# Altium schematic sheet 倒计时八路抢答器.SchDoc
size A4
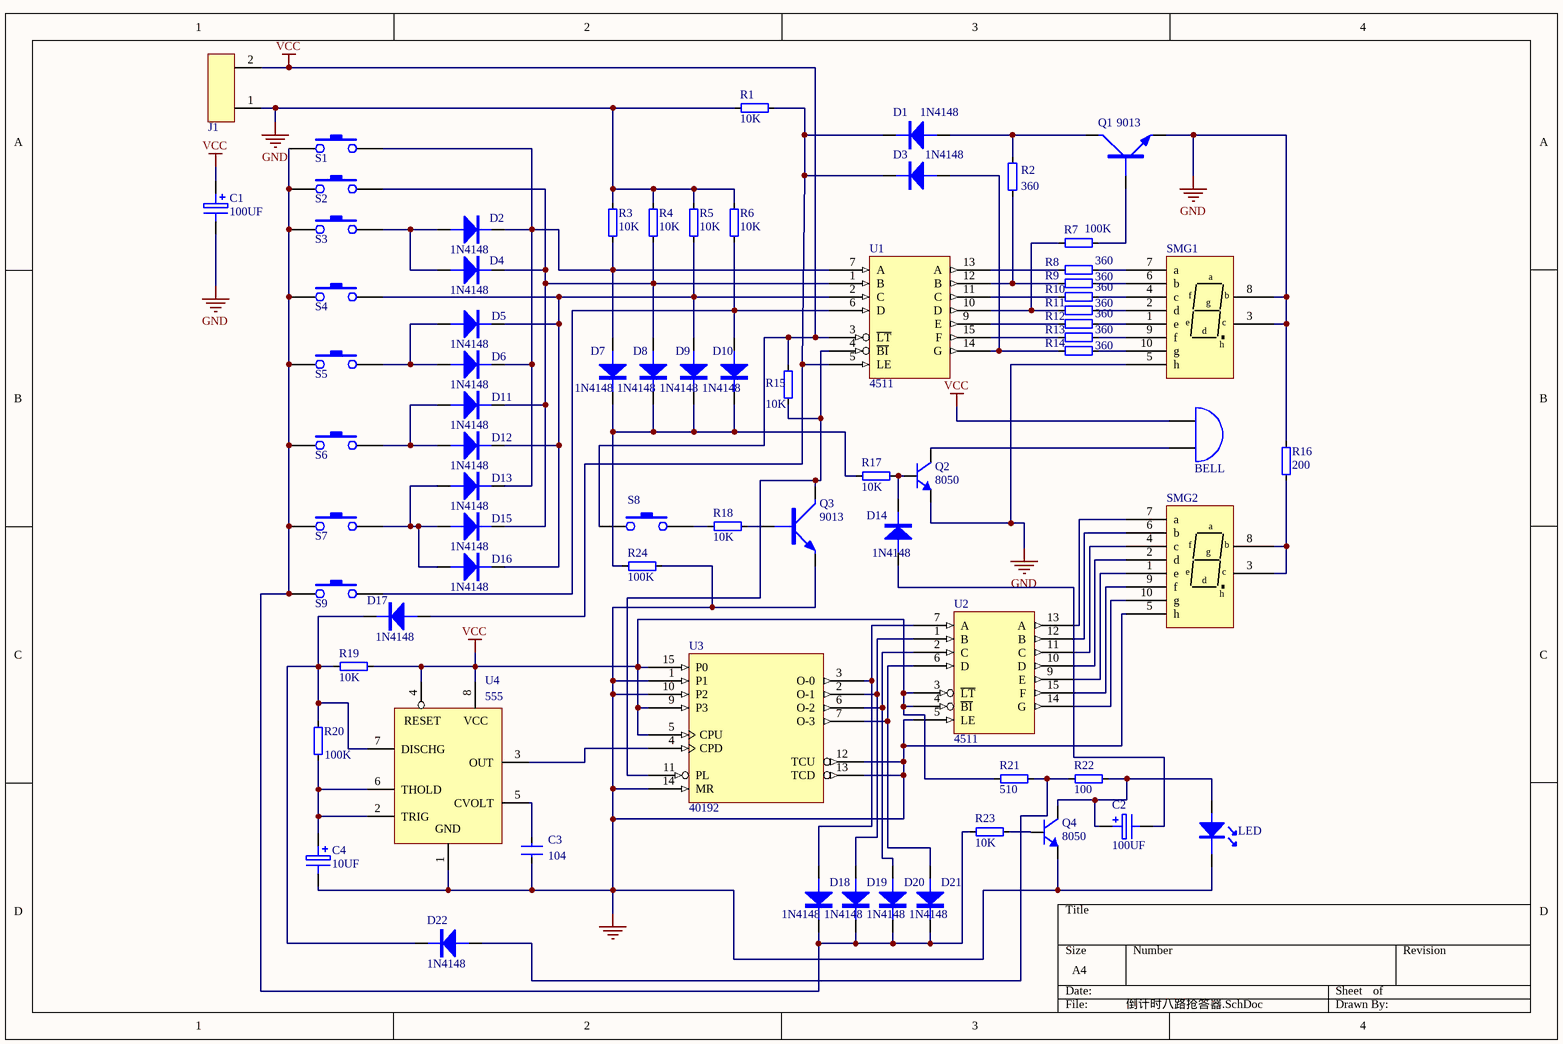
[diagram p0: 倒计时八路抢答器.SchDoc]

## Parts
?  BELL
C1  100UF  [RB.2/.4]
C2  100UF  [RB.2/.4]
C3  104  [0603C]
C4  10UF  [RB.2/.4]
D1  1N4148  [1N4148]
D2  1N4148  [1N4148]
D3  1N4148  [1N4148]
D4  1N4148  [1N4148]
D5  1N4148  [1N4148]
D6  1N4148  [1N4148]
D7  1N4148  [1N4148]
D8  1N4148  [1N4148]
D9  1N4148  [1N4148]
D10  1N4148  [1N4148]
D11  1N4148  [1N4148]
D12  1N4148  [1N4148]
D13  1N4148  [1N4148]
D14  1N4148  [DO-41]
D15  1N4148  [1N4148]
D16  1N4148  [1N4148]
D17  1N4148  [DO-41]
D18  1N4148  [DO-41]
D19  1N4148  [DO-41]
D20  1N4148  [DO-41]
D21  1N4148  [DO-41]
D22  1N4148  [DO-41]
J1  CON2  [KF-3.96-2P]  (value not drawn)
LED1  LED  [0805D]
Q1  9013  [8050-TO-92]
Q2  8050  [TO-92A]
Q3  9013  [8050-TO-92]
Q4  8050  [TO-92A]
R1  RES  [RES-0.25W]  (value not drawn)
R2  360  [RES-0.25W]
R3  10K  [0805R]
R4  10K  [0805R]
R5  10K  [0805R]
R6  10K  [0805R]
R7  (no value)  [RES-0.25W]
R8  360  [RES-0.25W]
R9  360  [RES-0.25W]
R10  360  [RES-0.25W]
R11  360  [RES-0.25W]
R12  360  [RES-0.25W]
R13  360  [RES-0.25W]
R14  360  [RES-0.25W]
R15  RES  [RES-0.25W]  (value not drawn)
R16  200  [0805R]
R17  RES  [RES-0.25W]  (value not drawn)
R18  RES  [RES-0.25W]  (value not drawn)
R19  10K  [0805R]
R20  100K  [0805R]
R21  510  [0805R]
R22  100  [0805R]
R23  10K  [0805R]
R24  100K  [0805R]
S1  SW-PB  [SW1]  (value not drawn)
S2  SW-PB  [SW1]  (value not drawn)
S3  SW-PB  [SW1]  (value not drawn)
S4  SW-PB  [SW1]  (value not drawn)
S5  SW-PB  [SW1]  (value not drawn)
S6  SW-PB  [SW1]  (value not drawn)
S7  SW-PB  [SW1]  (value not drawn)
S8  SW-PB  [SW1]  (value not drawn)
S9  SW-PB  [SW1]  (value not drawn)
SMG1  LED-1NUMBER  [0.56寸 1位数码管]  (value not drawn)
SMG2  LED-1NUMBER  [0.56寸 1位数码管]  (value not drawn)
U1  4511  [DIP-16]
U2  4511  [DIP-16]
U3  40192  [DIP-16]
U4  555  [DIP8]

## Nets
GND: C1.2 C3.2 C4.2 J1.1 LED1.K Q1.1(E) Q2.1(E) Q3.1(E) Q4.1(E) R1.1 R3.2 R4.2 R5.2 R6.2 R16.2 R24.2 SMG1.3(com) SMG1.5(h) SMG1.8(com) SMG2.5(h) U1.8(GND) U2.5(LE) U2.8(GND) U3.1(P1) U3.8(GND) U3.10(P2) U3.12(TCU) U3.13(TCD) U3.14(MR) U4.1(GND)
VCC: ?.1(A) C1.1 J1.2 R15.1 R19.2 R21.1 S8.1 U1.3(~{LT}) U1.16(VCC) U2.3(~{LT}) U2.4(~{BI}) U2.16(VCC) U3.5(CPU) U3.9(P3) U3.15(P0) U3.16(VCC) U4.4(RESET) U4.8(VCC)
Net?_2: ?.2(B) Q2.3(C)
NetC2_1: C2.1 LED1.A Q4.3(C) R22.2
NetC2_2: C2.2 D14.A
NetC3_1: C3.1 U4.5(CVOLT)
NetC4_1: C4.1 R20.1 U4.2(TRIG) U4.6(THOLD)
NetD1_1: D1.1 Q1.3(C) R2.2
NetD1_2: D1.2 D3.2 D17.A R1.2 U1.5(LE)
NetD2_1: D2.1 D4.1 S3.3
NetD2_2: D2.2 D8.1 D11.2 D15.2 R4.1 S2.3 U1.1(B)
NetD3_1: D3.1 R14.1 U1.14(G)
NetD4_2: D4.2 D6.2 D7.1 D13.2 R3.1 S1.3 U1.7(A)
NetD5_1: D5.1 D6.1 S5.3
NetD5_2: D5.2 D9.1 D12.2 D16.2 R5.1 S4.3 U1.2(C)
NetD7_2: D7.2 D8.2 D9.2 D10.2 R17.2 R24.1
NetD10_1: D10.1 R6.1 S9.3 U1.6(D)
NetD11_1: D11.1 D12.1 S6.3
NetD13_1: D13.1 D15.1 D16.1 S7.3
NetD14_K: D14.K Q2.2(B) R17.1
NetD17_K: D17.K D22.K R19.1 R20.2 U4.7(DISCHG)
NetD18_A: D18.A U2.7(A) U3.3(O-0)
NetD18_K: D18.K D19.K D20.K D21.K R23.1 S1.1 S2.1 S3.1 S4.1 S5.1 S6.1 S7.1 S9.1
NetD19_A: D19.A U2.1(B) U3.2(O-1)
NetD20_A: D20.A U2.2(C) U3.6(O-2)
NetD21_A: D21.A U2.6(D) U3.7(O-3)
NetD22_A: D22.A R21.2 R22.1
NetQ1_2: Q1.2(B) R7.2
NetQ3_2: Q3.2(B) R18.1
NetQ3_3: Q3.3(C) R15.2 U1.4(~{BI}) U3.11(PL)
NetQ4_2: Q4.2(B) R23.2
NetR2_1: R2.1 R9.1 U1.12(B)
NetR7_1: R7.1 R11.1 U1.10(D)
NetR8_1: R8.1 U1.13(A)
NetR8_2: R8.2 SMG1.7(a)
NetR9_2: R9.2 SMG1.6(b)
NetR10_1: R10.1 U1.11(C)
NetR10_2: R10.2 SMG1.4(c)
NetR11_2: R11.2 SMG1.2(d)
NetR12_1: R12.1 U1.9(E)
NetR12_2: R12.2 SMG1.1(e)
NetR13_1: R13.1 U1.15(F)
NetR13_2: R13.2 SMG1.9(f)
NetR14_2: R14.2 SMG1.10(g)
NetR16_1: R16.1 SMG2.3(com) SMG2.8(com)
NetR18_2: R18.2 S8.3
NetSMG2_1: SMG2.1(e) U2.9(E)
NetSMG2_2: SMG2.2(d) U2.10(D)
NetSMG2_4: SMG2.4(c) U2.11(C)
NetSMG2_6: SMG2.6(b) U2.12(B)
NetSMG2_7: SMG2.7(a) U2.13(A)
NetSMG2_9: SMG2.9(f) U2.15(F)
NetSMG2_10: SMG2.10(g) U2.14(G)
NetU3_4: U3.4(CPD) U4.3(OUT)

## Notes on the sheet
- (in symbol RES) 100K; 10K

## Library data of the parts
C1 C2 C4 = CAP-E: 电解电容
C3 = CAP-0.1UF: SMD-CAP
D1-D13 D15 D16 = DIODE
D14 D17-D22 = D-1N5819: Diode
J1 = CON2: SOCKET
LED1 = D-LED
Q1 Q3 = 9013: NPN Transistor
Q2 Q4 = Q-BC817: NPN General Purpose Amplifier; Published: 8-Jun-2000; LatestRevisionDate: 15-Jan-2003; LatestRevisionNote: PCB Footprint 'BCY-W3/D4.7' replaced; DatasheetDocument: 1997; PackageDocument: Sep-1998; PackageReference: TO-92A; Publisher: Altium Limited; Code_JEDEC: TO-92A; ComponentLink1Description: Manufacturer Link; ComponentLink1URL: http://www.fairchildsemi.com/; ComponentLink2Description: Datasheet; ComponentLink2URL: http://www.fairchildsemi.com/ds/2N%2F2N3904.pdf
R2 R7-R14 = RES
R3-R6 R16 R19-R24 = R-10K: resistor
SMG1 SMG2 = LED-1NUMBER: 数码管
U4 = 555: Timer